# EAGLE design Adaptor (EAGLE 6.4)
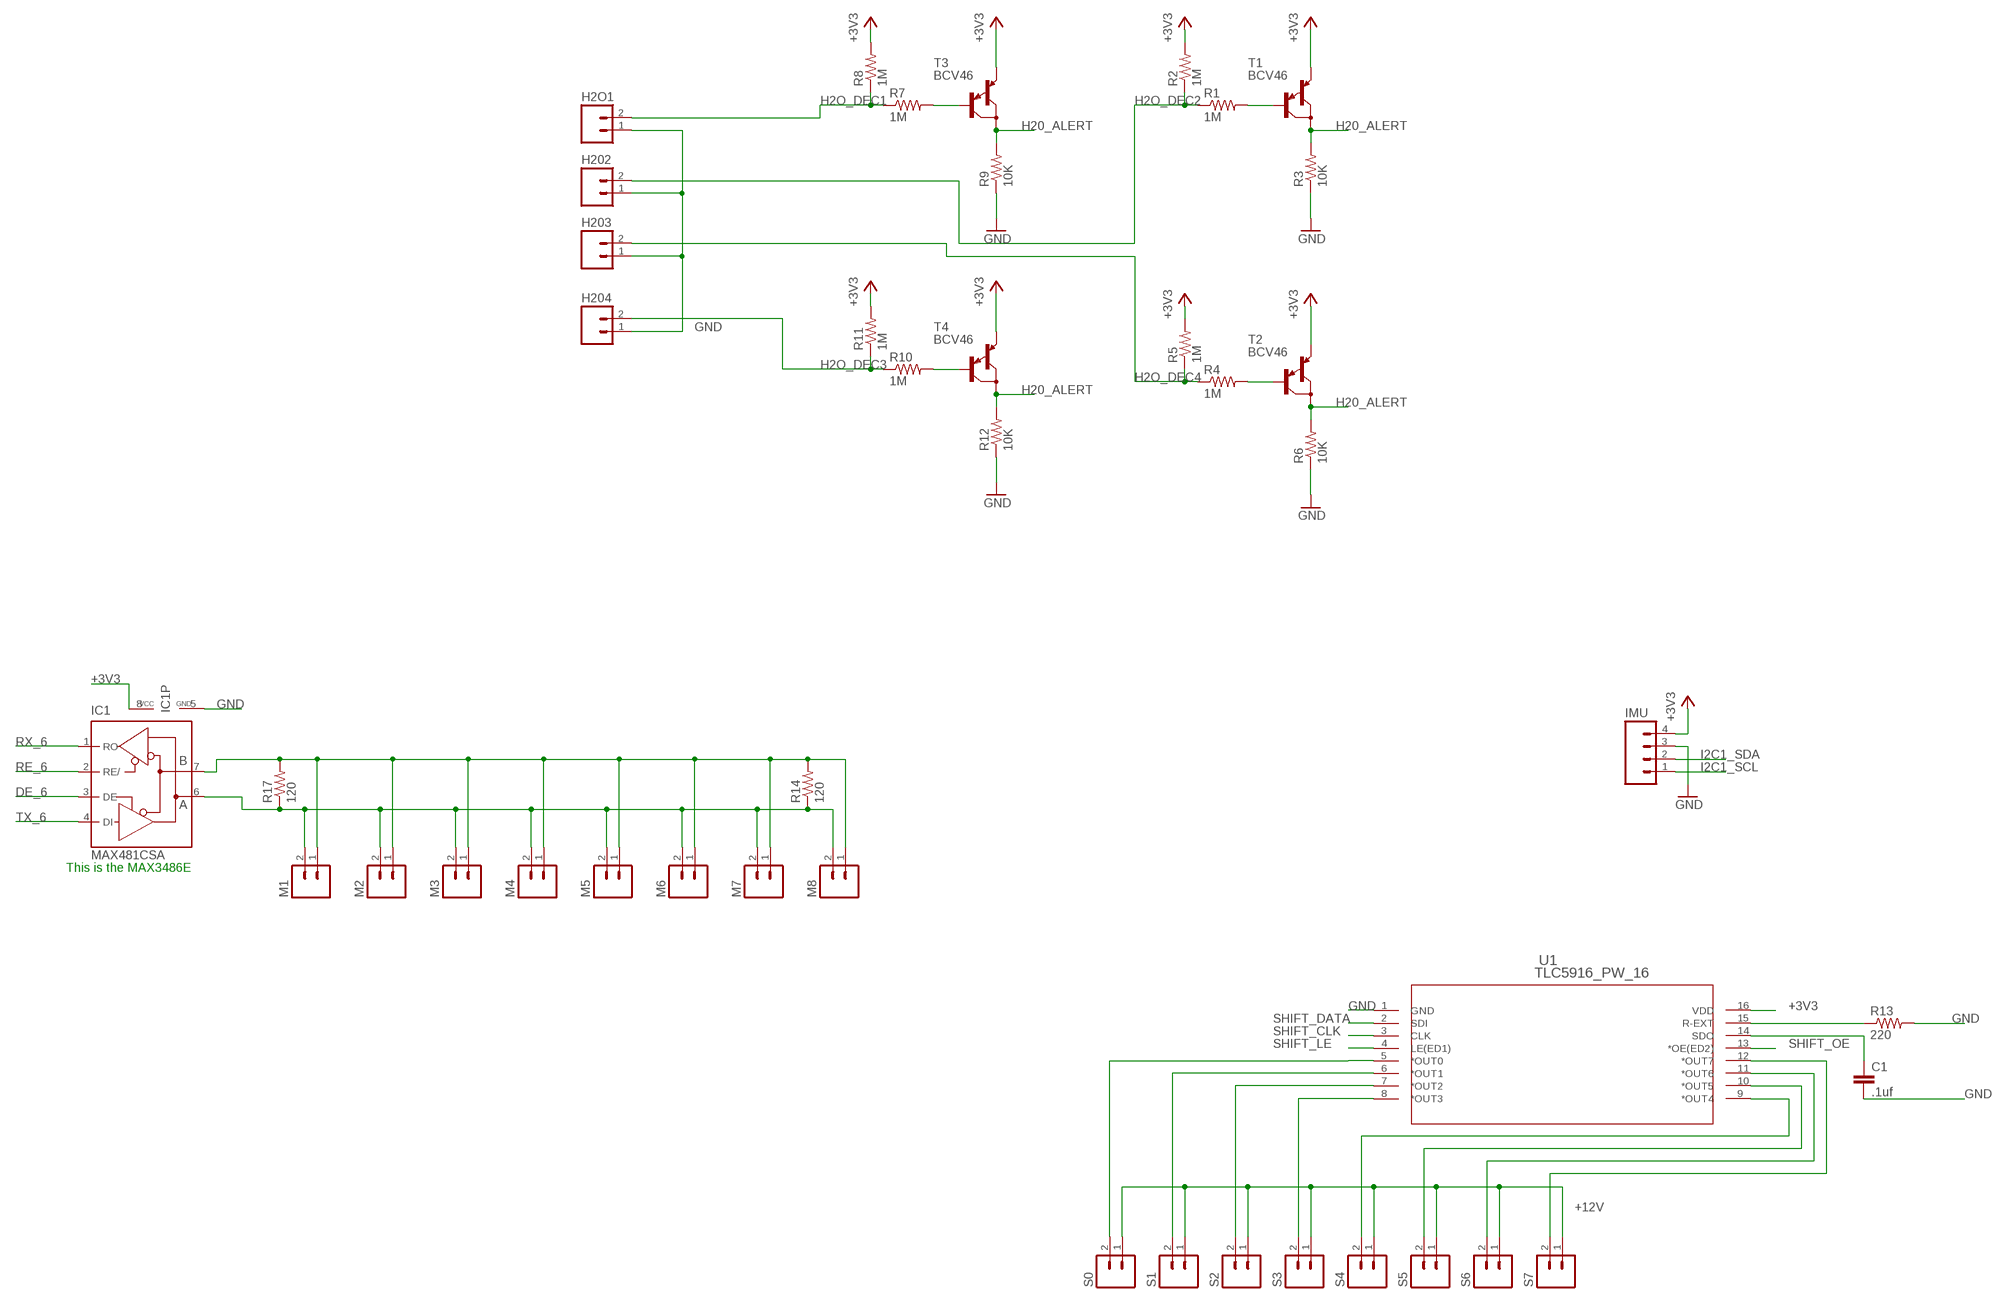
[diagram p0: schematic, sheet 1, part 1 of 2]
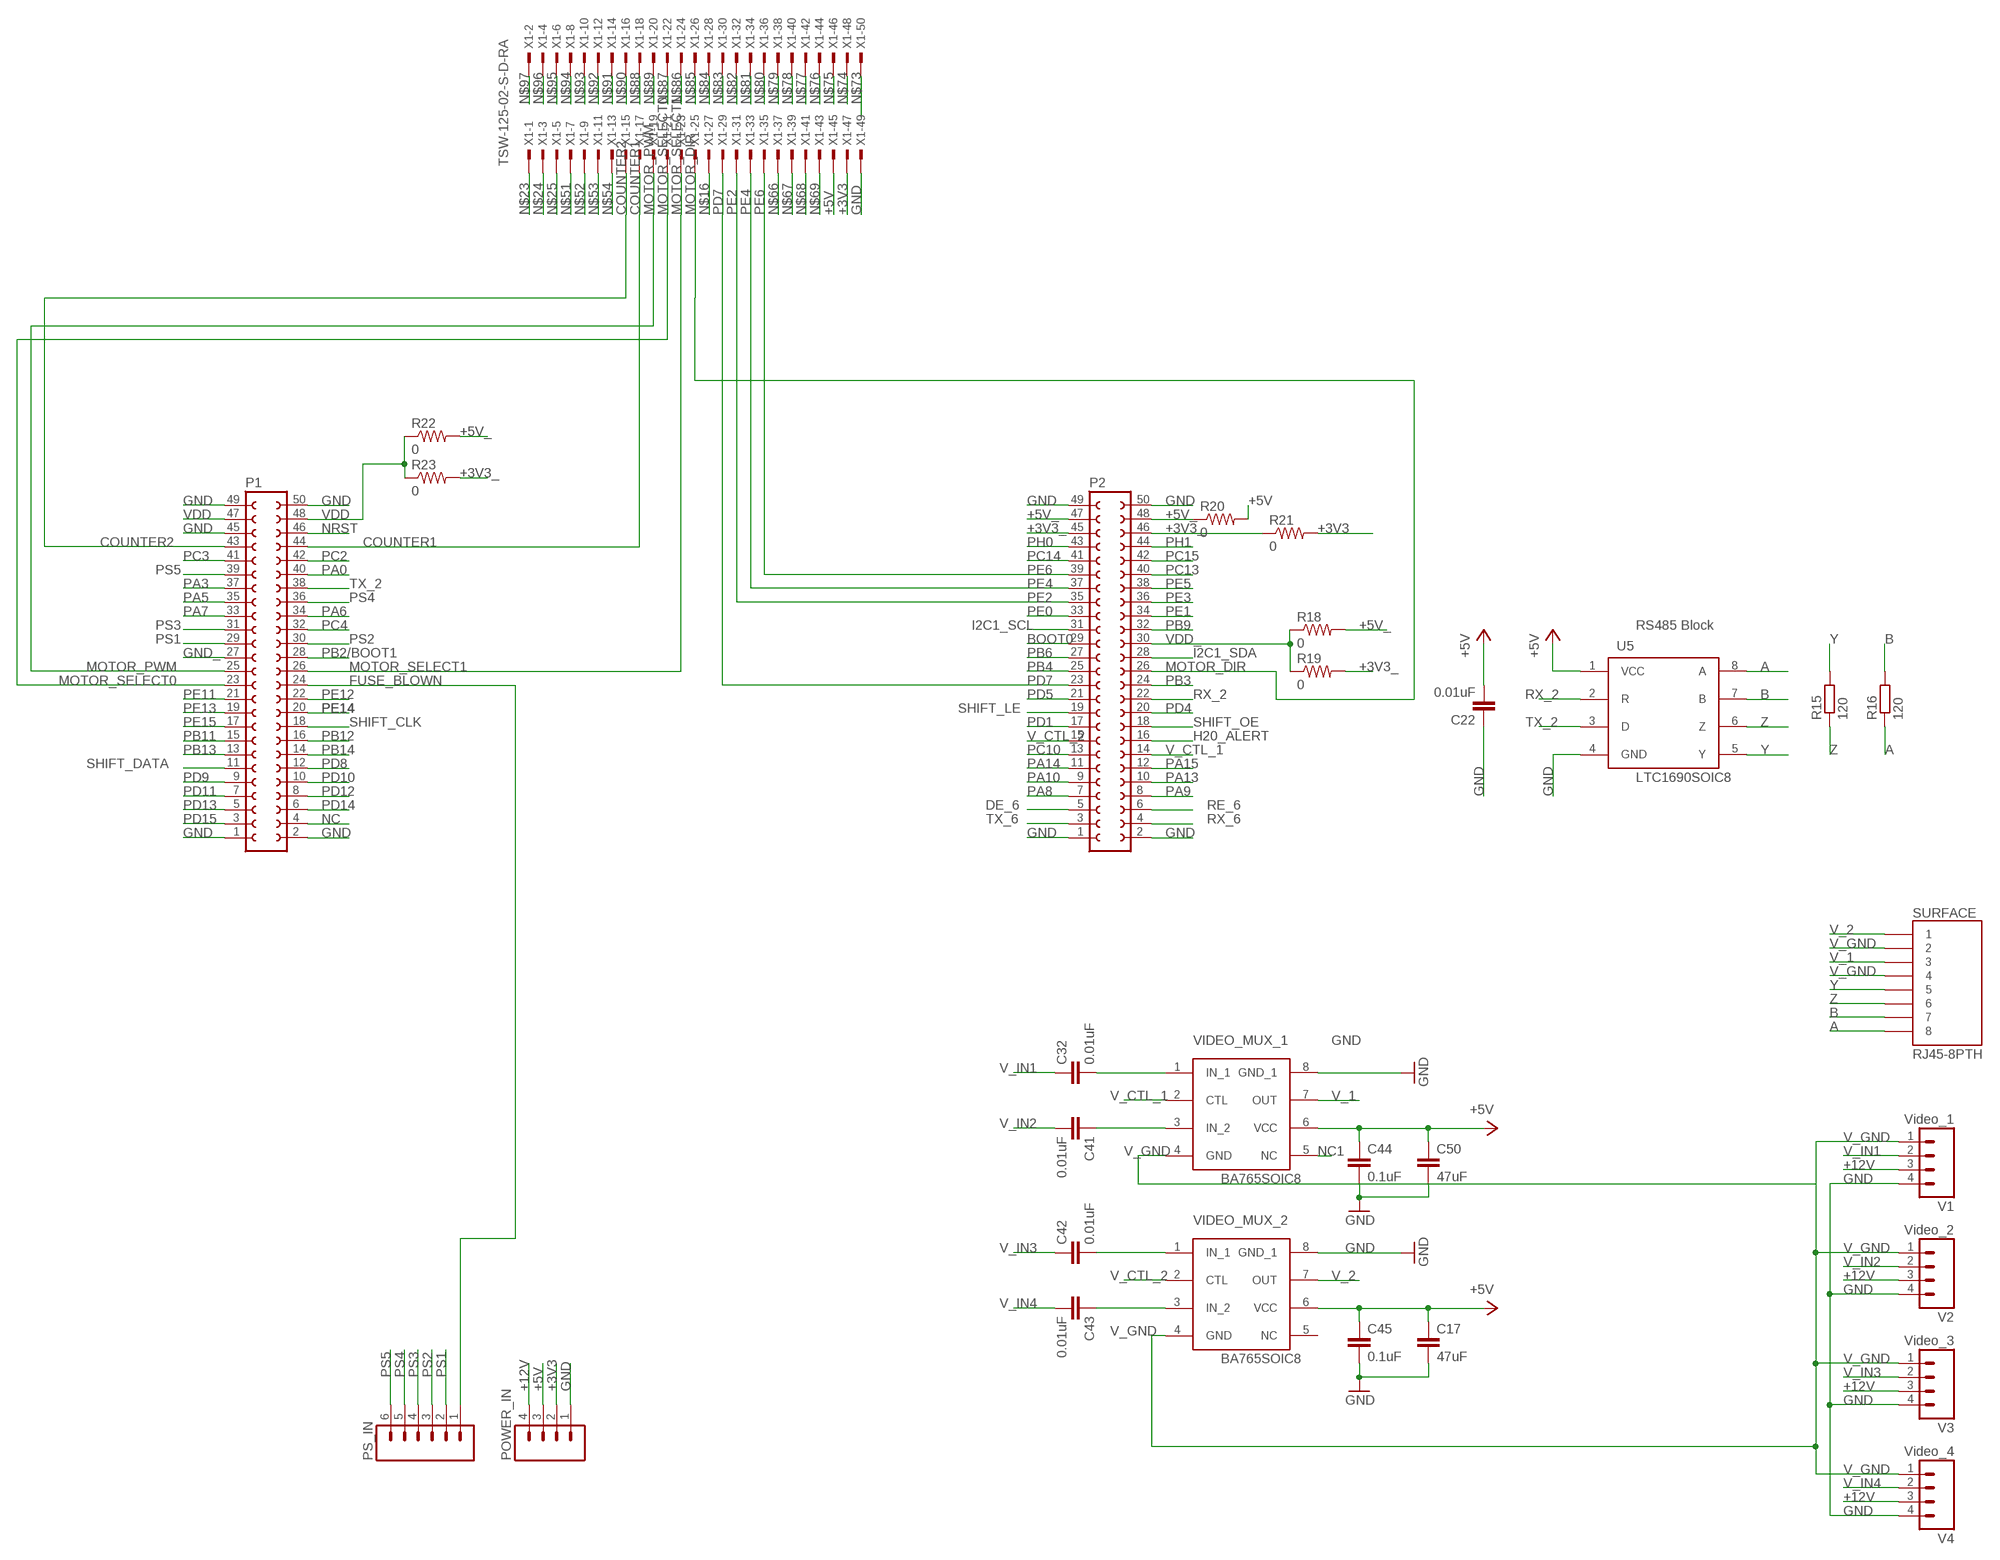
[diagram p1: schematic, sheet 1, part 2 of 2]

## Parts
C1  .1uf  CAP0805  [0805]
C17  47uF  C-EUC1206  [C1206]
C22  0.01uF  C-EUC0603  [C0603]
C32  0.01uF  C-EUC0603  [C0603]
C41  0.01uF  C-EUC0603  [C0603]
C42  0.01uF  C-EUC0603  [C0603]
C43  0.01uF  C-EUC0603  [C0603]
C44  0.1uF  C-EUC0603  [C0603]
C45  0.1uF  C-EUC0603  [C0603]
C50  47uF  C-EUC1206  [C1206]
H2O1  M02PTH  [1X02]
H202  M02PTH  [1X02]
H203  M02PTH  [1X02]
H204  M02PTH  [1X02]
IC1  MAX481CSA  [SO08]
IMU  M04PTH  [1X04]
M1  M02PTH  [1X02]
M2  M02PTH  [1X02]
M3  M02PTH  [1X02]
M4  M02PTH  [1X02]
M5  M02PTH  [1X02]
M6  M02PTH  [1X02]
M7  M02PTH  [1X02]
M8  M02PTH  [1X02]
P1  FE25-2  [FE25-2]
P2  FE25-2  [FE25-2]
POWER_IN  M04PTH  [1X04]
PS_IN  M06SIP  [1X06]
R1  1M  RESISTOR0805-RES  [0805]
R2  1M  RESISTOR0805-RES  [0805]
R3  10K  RESISTOR0805-RES  [0805]
R4  1M  RESISTOR0805-RES  [0805]
R5  1M  RESISTOR0805-RES  [0805]
R6  10K  RESISTOR0805-RES  [0805]
R7  1M  RESISTOR0805-RES  [0805]
R8  1M  RESISTOR0805-RES  [0805]
R9  10K  RESISTOR0805-RES  [0805]
R10  1M  RESISTOR0805-RES  [0805]
R11  1M  RESISTOR0805-RES  [0805]
R12  10K  RESISTOR0805-RES  [0805]
R13  220  RESISTOR0805-RES  [0805]
R14  120  RESISTOR0805-RES  [0805]
R15  120  R-EU_R0603  [R0603]
R16  120  R-EU_R0603  [R0603]
R17  120  RESISTOR0805-RES  [0805]
R18  0  RESISTOR0805-RES  [0805]
R19  0  RESISTOR0805-RES  [0805]
R20  0  RESISTOR0805-RES  [0805]
R21  0  RESISTOR0805-RES  [0805]
R22  0  RESISTOR0805-RES  [0805]
R23  0  RESISTOR0805-RES  [0805]
S0  M02PTH  [1X02]
S1  M02PTH  [1X02]
S2  M02PTH  [1X02]
S3  M02PTH  [1X02]
S4  M02PTH  [1X02]
S5  M02PTH  [1X02]
S6  M02PTH  [1X02]
S7  M02PTH  [1X02]
SURFACE  RJ45-8PTH  [RJ45-8]
T1  BCV46  MMBTA64LT1-PNP_DARL-SOT23-BEC  [SOT23-BEC]
T2  BCV46  MMBTA64LT1-PNP_DARL-SOT23-BEC  [SOT23-BEC]
T3  BCV46  MMBTA64LT1-PNP_DARL-SOT23-BEC  [SOT23-BEC]
T4  BCV46  MMBTA64LT1-PNP_DARL-SOT23-BEC  [SOT23-BEC]
U1  TLC5916_PW_16  [PW16]
U5  LTC1690SOIC8  [SOIC8]
V1  Video_1  M04PTH  [1X04]
V2  Video_2  M04PTH  [1X04]
V3  Video_3  M04PTH  [1X04]
V4  Video_4  M04PTH  [1X04]
VIDEO_MUX_1  BA765SOIC8  [SOIC8]
VIDEO_MUX_2  BA765SOIC8  [SOIC8]
X1  TSW-125-02-S-D-RA  [TSW-125-02-S-D-RA]

## Nets
+3V3: IC1.8(VCC) IMU.4 POWER_IN.2 R2.2 R5.2 R8.2 R11.2 R21.2 T1.E T2.E T3.E T4.E U1.16(VDD) X1.47
+3V3_: P2.45 P2.46 R19.2 R21.1 R23.2
+5V: C17.1 C22.2 C44.1 C45.1 C50.1 POWER_IN.3 R20.2 U5.1(VCC) VIDEO_MUX_1.6(VCC) VIDEO_MUX_2.6(VCC) X1.45
+5V_: P2.47 P2.48 R18.2 R20.1 R22.2
+12V: POWER_IN.4 S0.1 S1.1 S2.1 S3.1 S4.1 S5.1 S6.1 S7.1 V1.3 V2.3 V3.3 V4.3
A: R16.1 SURFACE.8 U5.8(A)
B: R16.2 SURFACE.7 U5.7(B)
BOOT0: P2.29
COUNTER1: P1.44 X1.17
COUNTER2: P1.43 X1.15
DE_6: IC1.3(DE) P2.5
FUSE_BLOWN: P1.24 PS_IN.1
GND: C1.2 C17.2 C22.1 C44.2 C45.2 C50.2 H2O1.1 H202.1 H203.1 H204.1 IC1.5(GND) IMU.3 P1.1 P1.2 P1.45 P1.49 P1.50 P2.1 P2.2 P2.49 P2.50 POWER_IN.1 R3.1 R6.1 R9.1 R12.1 R13.2 U1.1(GND) U5.4(GND) V1.4 V2.4 V3.4 V4.4 VIDEO_MUX_1.8(GND_1) VIDEO_MUX_2.8(GND_1) X1.49
GND_: P1.27
H2O_DEC1: H2O1.2 R7.1 R8.1
H2O_DEC2: H202.2 R1.1 R2.1
H2O_DEC3: H204.2 R10.1 R11.1
H2O_DEC4: H203.2 R4.1 R5.1
H20_ALERT: P2.16 R3.2 R6.2 R9.2 R12.2 T1.C T2.C T3.C T4.C
I2C1_SCL: IMU.1 P2.31
I2C1_SDA: IMU.2 P2.28
MOTOR_DIR: P2.26 X1.25
MOTOR_PWM: P1.25 X1.19
MOTOR_SELECT0: P1.23 X1.21
MOTOR_SELECT1: P1.26 X1.23
N$1: R1.2 T1.B
N$2: R4.2 T2.B
N$3: R7.2 T3.B
N$4: R10.2 T4.B
N$5: IC1.7(B) M1.1 M2.1 M3.1 M4.1 M5.1 M6.1 M7.1 M8.1 R14.2 R17.2
N$6: C32.2 VIDEO_MUX_1.1(IN_1)
N$8: C41.1 VIDEO_MUX_1.3(IN_2)
N$9: S0.2 U1.5(*OUT0)
N$10: S1.2 U1.6(*OUT1)
N$11: S2.2 U1.7(*OUT2)
N$12: S3.2 U1.8(*OUT3)
N$13: C42.2 VIDEO_MUX_2.1(IN_1)
N$14: R13.1 U1.15(R-EXT)
N$15: C1.1 U1.14(SDO)
N$16: X1.27
N$17: S7.2 U1.12(*OUT7)
N$18: S6.2 U1.11(*OUT6)
N$19: S5.2 U1.10(*OUT5)
N$20: S4.2 U1.9(*OUT4)
N$21: C43.1 VIDEO_MUX_2.3(IN_2)
N$22: IC1.6(A) M1.2 M2.2 M3.2 M4.2 M5.2 M6.2 M7.2 M8.2 R14.1 R17.1
N$23: X1.1
N$24: X1.3
N$25: X1.5
N$51: X1.7
N$52: X1.9
N$53: X1.11
N$54: X1.13
N$66: X1.37
N$67: X1.39
N$68: X1.41
N$69: X1.43
N$73: X1.50
N$74: X1.48
N$75: X1.46
N$76: X1.44
N$77: X1.42
N$78: X1.40
N$79: X1.38
N$80: X1.36
N$81: X1.34
N$82: X1.32
N$83: X1.30
N$84: X1.28
N$85: X1.26
N$86: X1.24
N$87: X1.22
N$88: X1.18
N$89: X1.20
N$90: X1.16
N$91: X1.14
N$92: X1.12
N$93: X1.10
N$94: X1.8
N$95: X1.6
N$96: X1.4
N$97: X1.2
NC: P1.4
NC1: VIDEO_MUX_1.5(NC)
NRST: P1.46
PA0: P1.40
PA3: P1.37
PA5: P1.35
PA6: P1.34
PA7: P1.33
PA8: P2.7
PA9: P2.8
PA10: P2.9
PA13: P2.10
PA14: P2.11
PA15: P2.12
PB2/BOOT1: P1.28
PB3: P2.24
PB4: P2.25
PB6: P2.27
PB9: P2.32
PB11: P1.15
PB12: P1.16
PB13: P1.13
PB14: P1.14
PC2: P1.42
PC3: P1.41
PC4: P1.32
PC10: P2.13
PC13: P2.40
PC14: P2.41
PC15: P2.42
PD1: P2.17
PD4: P2.20
PD5: P2.21
PD7: P2.23 X1.29
PD8: P1.12
PD9: P1.9
PD10: P1.10
PD11: P1.7
PD12: P1.8
PD13: P1.5
PD14: P1.6
PD15: P1.3
PE0: P2.33
PE1: P2.34
PE2: P2.35 X1.31
PE3: P2.36
PE4: P2.37 X1.33
PE5: P2.38
PE6: P2.39 X1.35
PE11: P1.21
PE12: P1.22
PE13: P1.19
PE14: P1.20
PE15: P1.17
PH0: P2.43
PH1: P2.44
PS1: P1.29 PS_IN.2
PS2: P1.30 PS_IN.3
PS3: P1.31 PS_IN.4
PS4: P1.36 PS_IN.5
PS5: P1.39 PS_IN.6
RE_6: IC1.2(RE/) P2.6
RX_2: P2.22 U5.2(R)
RX_6: IC1.1(RO) P2.4
SHIFT_CLK: P1.18 U1.3(CLK)
SHIFT_DATA: P1.11 U1.2(SDI)
SHIFT_LE: P2.19 U1.4(LE(ED1))
SHIFT_OE: P2.18 U1.13(*OE(ED2))
TX_2: P1.38 U5.3(D)
TX_6: IC1.4(DI) P2.3
V_1: SURFACE.3 VIDEO_MUX_1.7(OUT)
V_2: SURFACE.1 VIDEO_MUX_2.7(OUT)
V_CTL_1: P2.14 VIDEO_MUX_1.2(CTL)
V_CTL_2: P2.15 VIDEO_MUX_2.2(CTL)
V_GND: SURFACE.2 SURFACE.4 V1.1 V2.1 V3.1 V4.1 VIDEO_MUX_1.4(GND) VIDEO_MUX_2.4(GND)
V_IN1: C32.1 V1.2
V_IN2: C41.2 V2.2
V_IN3: C42.1 V3.2
V_IN4: C43.2 V4.2
VDD: P1.47 P1.48 R22.1 R23.1
VDD_: P2.30 R18.1 R19.1
Y: R15.2 SURFACE.5 U5.5(Y)
Z: R15.1 SURFACE.6 U5.6(Z)
Unconnected: VIDEO_MUX_2.5(NC)

## Notes on the sheet
- RS485 Block
- This is the MAX3486E

## Library data of the parts
C1 = SparkFun-Passives:CAP: Capacitor Standard 0603 ceramic capacitor, and 0.1" leaded capacitor.
C17 C50 = resistor:C-EU: CAPACITOR, European symbol; BOM: INCLUDE; PARTNO: 490-5528-1-ND
C22 C32 C41-C43 = resistor:C-EU: CAPACITOR, European symbol; BOM: INCLUDE; PARTNO: 478-1227-1-ND
C44 C45 = resistor:C-EU: CAPACITOR, European symbol; BOM: INCLUDE; PARTNO: 311-1344-1-ND
H2O1 H202-H204 M1-M8 S0 S1-S7 = SparkFun-Connectors:M02: Header 2 Standard 2-pin 0.1" header. Use with straight break away headers (SKU : PRT-00116), right angle break away headers (PRT-00553), swiss pins (PRT-00743), machine pins (PRT-00117), and female headers (PRT-00115). Molex polarized connector foot print use with SKU : PRT-08233 with associated crimp pins and housings.
IC1 = maxim:MAX481CSA: RS485 TRANSEIVER; MF: MAXIM; MPN: MAX481CSA; OC_FARNELL: unknown; OC_NEWARK: 90C3817
IMU POWER_IN V1-V4 = SparkFun-Connectors:M04: Header 4 Standard 4-pin 0.1" header. Use with straight break away headers (SKU : PRT-00116), right angle break away headers (PRT-00553), swiss pins (PRT-00743), machine pins (PRT-00117), and female headers (PRT-00115). Molex polarized connector foot print use with SKU : PRT-08231 with associated crimp pins and housings. 1MM SMD Version SKU: PRT-10208
P1 P2 = con-lsta:FE25-2: FEMALE HEADER; OC_FARNELL: unknown; OC_NEWARK: unknown
PS_IN = SparkFun-Connectors:M06: Header 6 Standard 6-pin 0.1" header. Use with straight break away headers (SKU : PRT-00116), right angle break away headers (PRT-00553), swiss pins (PRT-00743), machine pins (PRT-00117), and female headers (PRT-00115). Molex polarized connector foot print use with SKU : PRT-08094 with associated crimp pins and housings. NOTES ON THE VARIANTS LOCK and LOCK_LONGPADS... This footprint was designed to help hold the alignment of a through-hole component (i.e. 6-pin header) while soldering it into place. You may notice that each hole has been shifted either up or down by 0.005 of an inch from it's more standard position (which is a perfectly straight line). This slight alteration caused the pins (the squares in the middle) to touch the edges of the holes. Because they are alternating, it causes a "brace" to hold the component in place. 0.005 has proven to be the perfect amount of "off-center" position when using our standard breakaway headers. Although looks a little odd when you look at the bare footprint, once you have a header in there, the alteration is very hard to notice. Also, if you push a header all the way into place, it is covered up entirely on the bottom side. This idea of altering the position of holes to aid alignment will be further integrated into the Sparkfun Library for other footprints. It can help hold any component with 3 or more connection pins.
R1-R12 R18-R23 = SparkFun-Resistors:RESISTOR: Resistor Basic schematic elements and footprints for 0603, 1206, and PTH resistors.
R13 R14 R17 = SparkFun-Passives:RESISTOR: Resistor Basic schematic elements and footprints for 0603, 1206, and PTH resistors.
R15 R16 = resistor:R-EU_: RESISTOR, European symbol
SURFACE = SparkFun-Connectors:RJ45-8: RJ45 Jack Simple RJ45, 8-pin connection - connector for common Cat5, Cat5e, and Cat6 Ethernet cables. Footprint not yet proven in production. Connector sku is PRT-00643; Breakout PCB sku is BOB-00716.
T1-T4 = transistor-neu-to92:*-PNP_DARL-: PNP Darlington Transistor
U1 = tlc5916:TLC5916_PW_16; DATASHEETURL: http://www.ti.com/lit/gpn/TLC5916; DESCRIPTION: 8-Bit Constant-Current LED Sink Driver; FAMILY_NAME: LED DRIVER; GENERIC_PART_NUMBER: TLC5916; INDUSTRY_STD_PKG_TYPE: TSSOP; MANUFACTURER: Texas Instruments; MANUFACTURER_PART_NUMBER: tlc5916_pw_16; PACKAGE_DESIGNATOR: PW; PIN_COUNT: 16; VENDOR: Texas Instruments
U5 = ltc1690:LTC1690: RS485 transciever
VIDEO_MUX_1 VIDEO_MUX_2 = ba765:BA765
X1 = con-samtec:TSW-125-02-S-D: THROUGH-HOLE .025" SQ POST HEADER Source: Samtec TSW.pdf; OC_FARNELL: unknown; OC_NEWARK: unknown

## Board
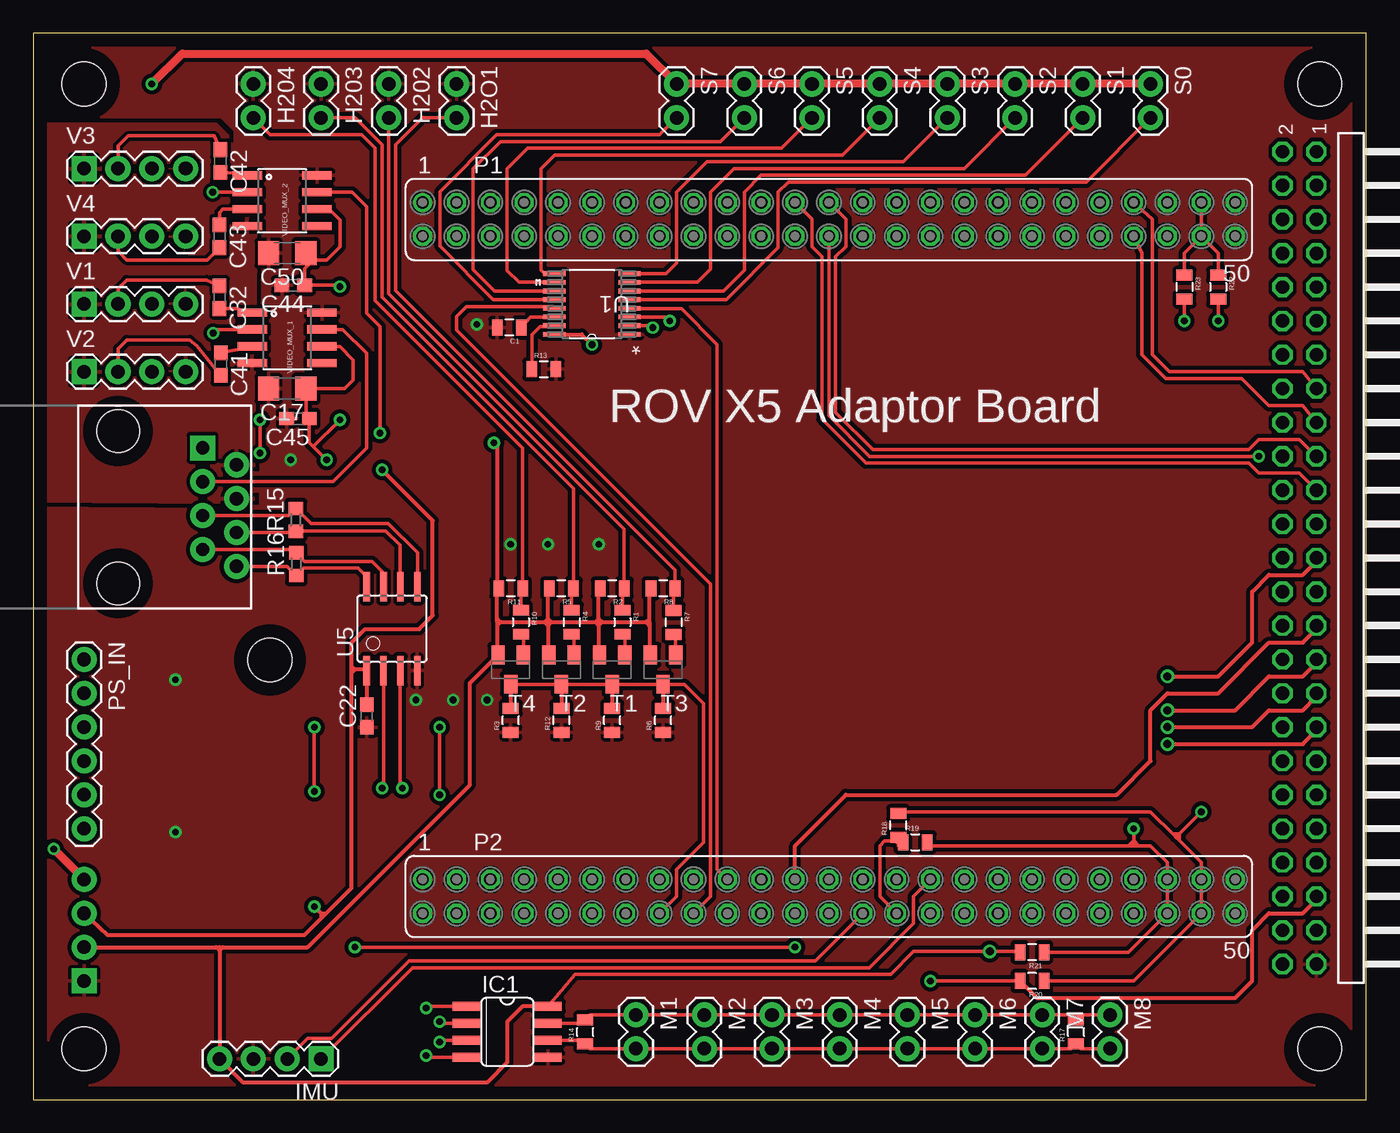
[diagram p2: board, top side]
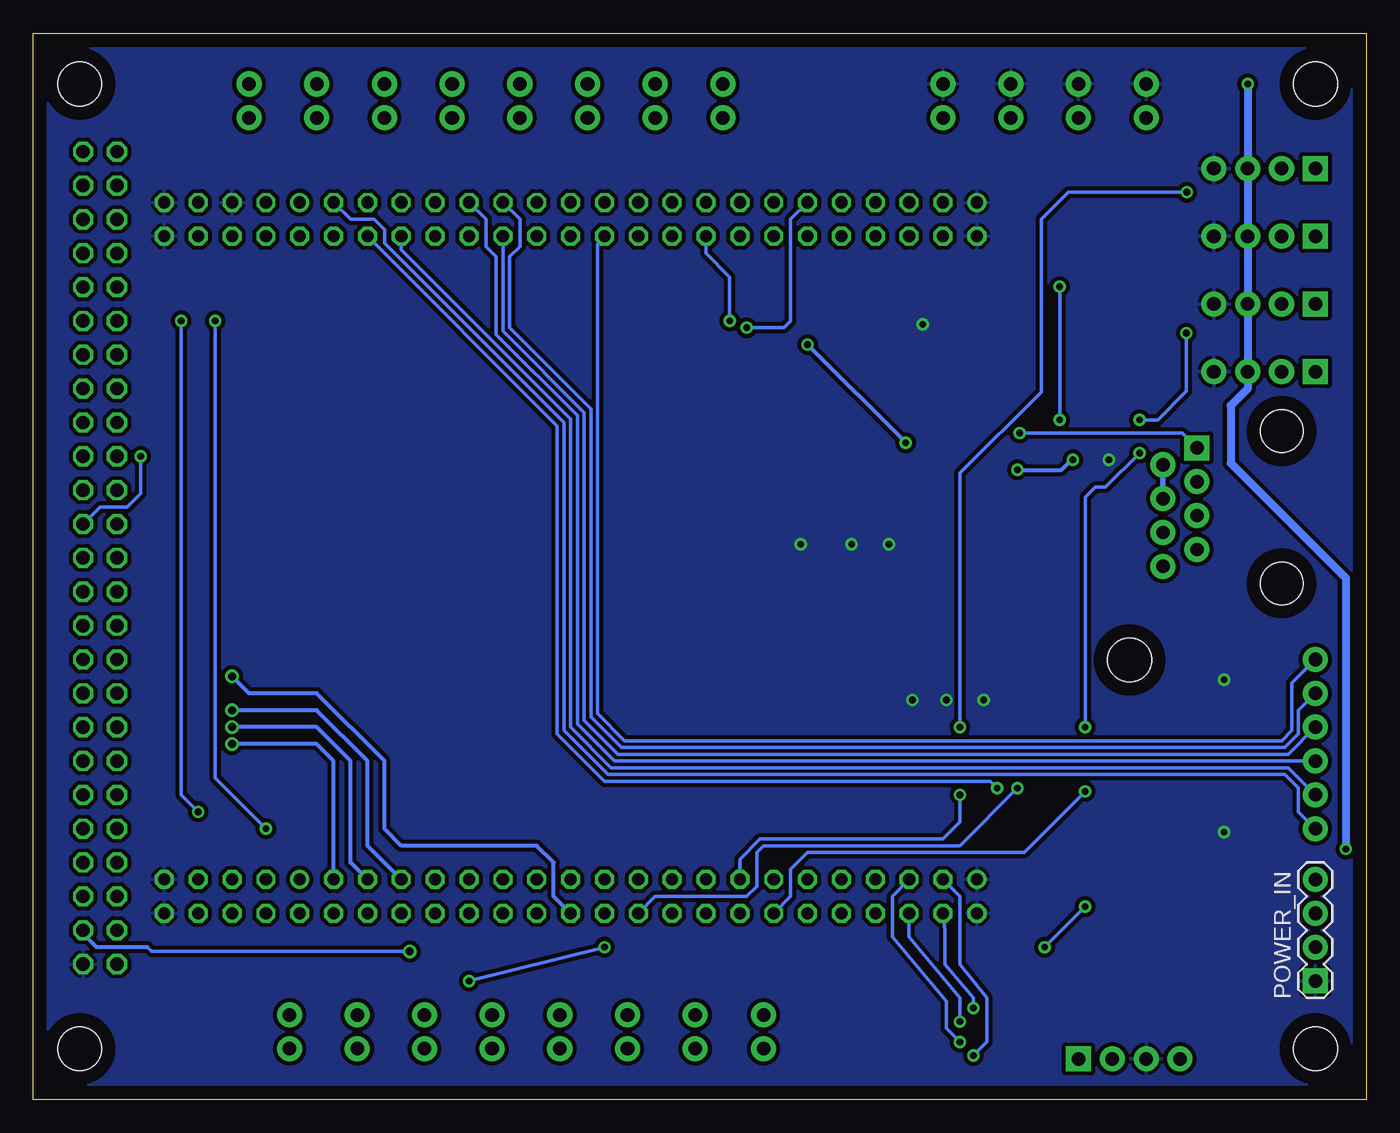
[diagram p3: board, bottom side, seen from below]

Size 100 x 80 mm. Coordinates in mm from the lower left corner, seen from the top.
Outline: 0,0 100,0 100,80 0,80 0,0
Copper layers (1*16): Top 0.035mm / dielectric 1.5mm / Bottom 0.035mm
Design rules "default": minimum track width 10mil, minimum drill 15mil, track to track 8mil, track to pad 8mil, pad to pad 8mil, via to via 8mil, smd to smd 8mil, copper to edge 40mil, drill to drill 8mil, minimum pad ring 10mil, minimum via ring 8mil, stop-mask expansion 4mil, vias tented up to drill 0mil, thermal gap 10mil

### Footprints (pad centres in the part's own frame; a part is rotated, then mirrored left to right if it is on the bottom)
0805 = smd 0.8 x 1.2: 1 -0.9,0; 2 0.9,0
C1206 = smd 1.6 x 1.8: 1 -1.4,0; 2 1.4,0
C0603 = smd 1.1 x 1: 1 -0.85,0; 2 0.85,0
1X02 = drill 1.016 pad 1.88: 1 0,0; 2 2.54,0
SO08 = smd 0.66 x 2.032: 1 -1.905,-3.073; 2 -0.635,-3.073; 3 0.635,-3.073; 4 1.905,-3.073; 5 1.905,3.073; 6 0.635,3.073; 7 -0.635,3.073; 8 -1.905,3.073
1X04 = drill 1.016 pad 1.88 square: 1 0,0 | drill 1.016 pad 1.88: 2 2.54,0; 3 5.08,0; 4 7.62,0
FE25-2 = drill 0.914: 1 -30.48,1.27; 41 20.32,1.27 | drill 0.914 octagon: 2 -30.48,-1.27; 3 -27.94,1.27; 4 -27.94,-1.27; 5 -25.4,1.27; 6 -25.4,-1.27; 7 -22.86,1.27; 8 -22.86,-1.27; 9 -20.32,1.27; 10 -20.32,-1.27; 11 -17.78,1.27; 12 -17.78,-1.27; 13 -15.24,1.27; 14 -15.24,-1.27; 15 -12.7,1.27; 16 -12.7,-1.27; 17 -10.16,1.27; 18 -10.16,-1.27; 19 -7.62,1.27; 20 -7.62,-1.27; 21 -5.08,1.27; 22 -5.08,-1.27; 23 -2.54,1.27; 24 -2.54,-1.27; 25 0,1.27; 26 0,-1.27; 27 2.54,1.27; 28 2.54,-1.27; 29 5.08,1.27; 30 5.08,-1.27; 31 7.62,1.27; 32 7.62,-1.27; 33 10.16,1.27; 34 10.16,-1.27; 35 12.7,1.27; 36 12.7,-1.27; 37 15.24,1.27; 38 15.24,-1.27; 39 17.78,1.27; 40 17.78,-1.27; 42 20.32,-1.27; 43 22.86,1.27; 44 22.86,-1.27; 45 25.4,1.27; 46 25.4,-1.27; 47 27.94,1.27; 48 27.94,-1.27; 49 30.48,1.27; 50 30.48,-1.27
1X06 = drill 1.016 pad 1.88: 1 0,0; 2 2.54,0; 3 5.08,0; 4 7.62,0; 5 10.16,0; 6 12.7,0
R0603 = smd 1 x 1.1: 1 -0.85,0; 2 0.85,0
RJ45-8 = drill 1 pad 1.88 square: 1 -4.445,6.35 | drill 1 pad 1.88: 2 -3.175,8.89; 3 -1.905,6.35; 4 -0.635,8.89; 5 0.635,6.35; 6 1.905,8.89; 7 3.175,6.35; 8 4.445,8.89 | hole 3.2: -5.715,0; 5.715,0
SOT23-BEC = smd 1 x 1.4: B -0.95,-1.1; C 0,1.1; E 0.95,-1.1
PW16 = smd 1.676 x 0.356: 1 -2.819,2.286; 2 -2.819,1.626; 3 -2.819,0.965; 4 -2.819,0.33; 5 -2.819,-0.33; 6 -2.819,-0.965; 7 -2.819,-1.626; 8 -2.819,-2.286; 9 2.819,-2.286; 10 2.819,-1.626; 11 2.819,-0.965; 12 2.819,-0.33; 13 2.819,0.33; 14 2.819,0.965; 15 2.819,1.626; 16 2.819,2.286
SOIC8 = smd 0.5 x 2.2: 1 -1.905,-3.154; 2 -0.645,-3.154; 3 0.625,-3.154; 4 1.895,-3.154; 5 1.905,3.154; 6 0.635,3.154; 7 -0.635,3.154; 8 -1.905,3.154
STAND-OFF = hole 3.302: 0,0
SOIC8' = smd 0.61 x 2.21: 1 -1.905,-2.616; 2 -0.635,-2.616; 3 0.635,-2.616; 4 1.905,-2.616; 5 1.905,2.616; 6 0.635,2.616; 7 -0.635,2.616; 8 -1.905,2.616
TSW-125-02-S-D-RA = drill 1 pad 1.5 octagon: 1 30.48,1.524; 2 30.48,4.064; 3 27.94,1.524; 4 27.94,4.064; 5 25.4,1.524; 6 25.4,4.064; 7 22.86,1.524; 8 22.86,4.064; 9 20.32,1.524; 10 20.32,4.064; 11 17.78,1.524; 12 17.78,4.064; 13 15.24,1.524; 14 15.24,4.064; 15 12.7,1.524; 16 12.7,4.064; 17 10.16,1.524; 18 10.16,4.064; 19 7.62,1.524; 20 7.62,4.064; 21 5.08,1.524; 22 5.08,4.064; 23 2.54,1.524; 24 2.54,4.064; 25 0,1.524; 26 0,4.064; 27 -2.54,1.524; 28 -2.54,4.064; 29 -5.08,1.524; 30 -5.08,4.064; 31 -7.62,1.524; 32 -7.62,4.064; 33 -10.16,1.524; 34 -10.16,4.064; 35 -12.7,1.524; 36 -12.7,4.064; 37 -15.24,1.524; 38 -15.24,4.064; 39 -17.78,1.524; 40 -17.78,4.064; 41 -20.32,1.524; 42 -20.32,4.064; 43 -22.86,1.524; 44 -22.86,4.064; 45 -25.4,1.524; 46 -25.4,4.064; 47 -27.94,1.524; 48 -27.94,4.064; 49 -30.48,1.524; 50 -30.48,4.064

### Placement (x,y rotation side)
C1  35.71,57.92 180 top
C17  19.05,53.34 180 top
C22  25.02,28.78 90 top
C32  13.97,60.19 270 top
C41  14.07,55.19 270 top
C42  14.03,70.42 270 top
C43  13.97,64.77 270 top
C44  19.5,61.09 180 top
C45  19.85,51.09 180 top
C50  19.05,63.5 180 top
H2O1  31.75,76.2 270 top
H202  26.67,76.2 270 top
H203  21.59,76.2 270 top
H204  16.51,76.2 270 top
IC1  35.56,5.08 270 top
IMU  21.59,3.05 180 top
M1  45.21,6.35 270 top
M2  50.34,6.35 270 top
M3  55.42,6.35 270 top
M4  60.5,6.35 270 top
M5  65.58,6.35 270 top
M6  70.66,6.35 270 top
M7  75.69,6.35 270 top
M8  80.77,6.35 270 top
P1  59.69,66.04 0 top
P2  59.69,15.24 0 top
POWER_IN  3.81,8.89 90 bottom
PS_IN  3.81,33.02 270 top
R1  44.2,35.81 270 top
R2  43.43,38.35 180 top
R3  35.81,28.45 90 top
R4  40.39,35.81 270 top
R5  39.62,38.35 180 top
R6  47.24,28.45 90 top
R7  48.04,35.79 270 top
R8  47.24,38.35 180 top
R9  43.43,28.45 90 top
R10  36.58,35.81 270 top
R11  35.81,38.35 180 top
R12  39.62,28.45 90 top
R13  38.3,54.79 0 top
R14  41.4,5.08 90 top
R15  19.69,43.5 90 top
R16  19.73,40.16 90 top
R17  78.23,5.08 90 top
R18  64.9,20.57 90 top
R19  66.17,19.3 0 top
R20  74.93,8.89 180 top
R21  74.93,11.05 180 top
R22  88.9,60.96 270 top
R23  86.36,60.96 270 top
S0  83.82,76.2 270 top
S1  78.74,76.2 270 top
S2  73.66,76.2 270 top
S3  68.58,76.2 270 top
S4  63.5,76.2 270 top
S5  58.42,76.2 270 top
S6  53.34,76.2 270 top
S7  48.26,76.2 270 top
SURFACE  6.35,44.45 270 top
T1  43.43,32.26 180 top
T2  39.62,32.26 180 top
T3  47.24,32.26 180 top
T4  35.81,32.26 180 top
U1  41.91,59.69 180 top
U5  26.91,35.33 0 top
U$1  [STAND-OFF]  3.81,76.2 0 top
U$2  [STAND-OFF]  3.81,3.81 0 top
U$3  [STAND-OFF]  96.52,3.81 0 top
U$4  [STAND-OFF]  96.52,76.2 0 top
U$5  [STAND-OFF]  17.75,32.98 0 top
V1  3.81,59.69 0 top
V2  3.81,54.61 0 top
V3  3.81,69.85 0 top
V4  3.81,64.77 0 top
VIDEO_MUX_1  BA765SOIC8  [SOIC8']  19.05,57.15 270 top
VIDEO_MUX_2  BA765SOIC8  [SOIC8']  18.67,67.44 270 top
X1  97.79,40.64 90 top

### Tracks (layer width: path | path; a pad name or v marks a point on that pad's centre or on a via)
+3V3  (via drill 0.51, 0.6)
  Top 0.254: IC1.8 40.64,9.4 64.33,9.4 66.04,11.11 v71.75,11.11 73.97,11.11 R21.2
  Top 0.305: POWER_IN.2 13.72,11.43 | 13.72,11.43 13.97,11.43 | 13.97,11.43 13.97,11.18 | 13.97,11.18 IMU.4 15.75,1.27 34.04,1.27 35.56,2.79 35.56,5.84 36.7,6.99 IC1.8 | 46.29,38.3 R8.2 46.23,38.24 46.23,36.07 | 34.8,35.81 35.05,35.81 | 35.05,35.81 38.35,35.81 | 38.35,35.81 38.61,35.81 | 38.61,35.81 38.86,35.81 | 38.86,35.81 42.16,35.81 | 42.16,35.81 42.42,35.81 | 42.42,35.81 42.67,35.81 | 42.67,35.81 45.97,35.81 | 45.97,35.81 46.23,35.81 | 46.23,35.81 46.23,35.56 | 46.23,35.56 46.23,33.42 T3.E | 46.23,35.81 46.23,36.07 | 46.23,36.07 45.97,35.81 | 45.97,35.81 46.23,35.56 | 42.42,35.81 42.42,35.56 | 42.42,35.56 42.42,33.42 T1.E | 42.42,35.81 42.42,36.07 | 42.42,36.07 42.42,38.24 R2.2 | 42.42,36.07 42.16,35.81 | 42.16,35.81 42.42,35.56 | 42.42,35.56 42.67,35.81 | 42.67,35.81 42.42,36.07 | 38.61,35.81 38.61,36.07 | 38.61,36.07 38.61,38.24 R5.2 | 38.61,35.81 38.61,35.56 | 38.61,35.56 38.61,33.42 T2.E | 38.35,35.81 38.61,36.07 | 38.61,36.07 38.86,35.81 | 38.86,35.81 38.61,35.56 | 38.61,35.56 38.35,35.81 | 34.8,35.81 34.8,36.07 | 34.8,36.07 34.8,38.24 R11.2 34.8,38.47 34.8,49.02 v34.54,49.28 | 34.8,35.81 34.8,35.56 | 34.8,35.56 34.8,33.42 T4.E 32.77,31.24 32.77,23.62 20.57,11.43 14.22,11.43 | 34.8,36.07 35.05,35.81 | 35.05,35.81 34.8,35.56 | U1.16 41.15,57.4 v41.91,56.64 | 13.97,11.43 14.22,11.43 | 14.22,11.43 13.97,11.18 | 13.97,11.18 13.72,11.43
  Bottom 0.254: v71.75,11.11 91.12,11.11 91.44,11.43
  Bottom 0.305: v41.91,56.64 v34.54,49.28 | 91.44,11.43 95.25,11.43 96.27,12.45 X1.47
+3V3_  (via drill 0.51)
  Top 0.254: 82.93,19.05 83.82,19.05 85.09,17.78 P2.45 P2.46 82.17,11.05 R21.1 | 82.93,19.05 82.55,19.05 | 82.17,19.05 67.31,19.05 67.31,19.06 R19.2 | R23.2 v86.36,58.42 | v82.55,20.32 82.55,19.43 | 82.55,19.43 82.55,19.05 | 82.55,19.43 82.17,19.05 | 82.17,19.05 82.55,19.05 | 82.93,19.05 82.55,19.43
  Bottom 0.254: v86.36,58.42 86.36,24.13 v82.55,20.32
+5V  (via drill 0.51)
  Top 0.254: VIDEO_MUX_2.6 22.2,66.8 23,66 23,64 22,63 21,63 | 21,63 20.95,63 C50.1 | 21,63 20.35,62.35 C44.1 22.91,61.09 v23,61 | VIDEO_MUX_1.6 21.68,56.5 23,56.5 24,55.5 24,54 23.34,53.34 C17.1 20.45,51.34 C45.1 20.7,49.3 21,49 | 21,49 v22,48 | v23,51 21,49 | v57.15,11.43 v24.13,11.43 | v67.31,8.89 R20.2
  Top 0.305: 23.88,32 23.88,15.88 21.97,13.97 | 23.88,32 23.88,32.26 | 23.88,32.26 23.88,32.51 | 24.13,32.26 24.92,32.26 U5.1 25,29.64 C22.2 | 24.13,32.26 23.88,32.26 | 23.88,32.51 24.13,32.26 | 24.13,32.26 23.88,32 | 23.88,32.51 23.88,34.29 24.89,35.31 28.96,35.31 29.97,36.32 29.97,43.43 v26.16,47.24 | POWER_IN.3 5.59,12.32 20.32,12.32 21.59,13.59 | v21.08,14.48 21.59,13.97 | 21.59,13.97 21.97,13.97 | 21.59,13.97 21.59,13.59 | 21.59,13.59 21.97,13.97 | R20.2 75.3,7.62 90.17,7.62 91.44,8.89 91.44,12.7 92.71,13.97 95.25,13.97 96.27,14.99 X1.45
  Bottom 0.254: v23,61 v23,51 | v67.31,8.89 v57.15,11.43 | v24.13,11.43 v21.08,14.48
  Bottom 0.305: v26.16,47.24 22.86,47.24 22.1,48.01 22.09,48 v22,48
+5V_  (via drill 0.51)
  Top 0.254: 85.98,19.43 87.63,17.78 P2.47 P2.48 82.55,8.89 R20.1 | 85.98,19.43 85.72,19.68 | 85.72,19.68 85.6,19.81 | 85.6,19.81 83.82,21.59 64.78,21.59 | 64.77,21.59 64.78,21.59 | 64.78,21.59 R18.2 | R22.2 v88.9,58.42 | v87.63,21.59 85.98,19.94 | 85.85,19.81 85.72,19.68 | 85.98,19.43 85.98,19.94 | 85.6,19.81 85.85,19.81 | 85.85,19.81 85.98,19.94 | 85.98,19.94 85.6,19.94
  Bottom 0.254: v88.9,58.42 88.9,22.86 v87.63,21.59
+12V  (via drill 0.51)
  Top 0.61: S0.1 S1.1 S2.1 S3.1 S4.1 S5.1 S6.1 S7.1 45.97,78.49 11.18,78.49 v8.89,76.2 | v1.52,18.8 POWER_IN.4
  Bottom 0.61: v8.89,76.2 V3.3 V4.3 V1.3 V2.3 8.89,53.34 10.16,52.07 10.16,47.75 1.52,39.12 v1.52,18.8
A
  Top 0.254: U5.8 25,39.26 24.38,39.88 20.29,39.88 R16.1 19.04,40.01 SURFACE.8
B
  Top 0.254: SURFACE.7 19.46,41.27 R16.2 20.35,40.39 25.4,40.39 26.27,39.51 U5.7
COUNTER1
  Top 0.254: X1.17 95.25,52.07 92.71,52.07 90.68,54.1 84.96,54.1 83.19,55.88 83.19,63.5 P1.44
COUNTER2
  Top 0.254: X1.15 95.25,54.61 85.22,54.61 83.95,55.88 83.95,66.04 P1.43
DE_6  (via drill 0.51)
  Top 0.254: IC1.3 30.61,4.45 v30.48,4.32
  Bottom 0.254: v30.48,4.32 31.5,5.33 31.5,7.37 35.56,12.19 35.56,15.24 P2.5
FUSE_BLOWN
  Bottom 0.254: P1.24 57.15,64.71 57.66,64.2 57.66,28.96 55.63,26.92 6.35,26.92 5.59,27.69 5.59,31.24 PS_IN.1
GND  (via drill 0.51)
  other vias: 33.27,58.17 28.7,29.97 31.5,29.97 34.04,29.97 38.61,41.66 42.42,41.66 35.81,41.66 10.67,31.5 10.67,20.07 19.3,48.01
  pour Top (isolate 0.305, rank 6): 0,80.01 100.33,80.01 100.33,0 0,0
  pour Bottom (isolate 0.305, rank 6): 0,80 100,80 100,0 0,0
H2O_DEC1
  Top 0.254: H2O1.2 29.21,73.66 27.18,71.63 27.18,60.71 48.14,39.74 R8.1 48.04,38.25 R7.1
H2O_DEC2
  Top 0.254: H202.2 26.67,60.45 44.33,42.79 R2.1 44.2,38.22 R1.1
H2O_DEC3
  Top 0.254: H204.2 17.78,72.39 24.64,72.39 25.65,71.37 25.65,59.94 36.71,48.88 R11.1 36.58,38.22 R10.1
H2O_DEC4
  Top 0.254: H203.2 24.13,73.66 26.16,71.63 26.16,60.2 40.52,45.84 R5.1 40.39,38.22 R4.1
H20_ALERT
  Top 0.254: P2.16 48.26,15.24 48.26,17.27 50.29,19.3 50.29,29.72 48.85,31.16 T3.C T1.C T2.C T4.C
  Top 0.305: T4.C R3.2 | T2.C R12.2 | T1.C R9.2 | T3.C R6.2
I2C1_SCL
  Top 0.254: IMU.1 28.44,9.9 62.73,9.9 66.04,13.21 66.04,15.24 P2.31
I2C1_SDA
  Top 0.254: IMU.2 20.59,4.59 22.37,4.59 28.19,10.41 58.67,10.41 P2.28
MOTOR_DIR  (via drill 0.6)
  Top 0.305: v85.09,31.75 88.9,31.75 91.44,34.29 91.44,38.1 92.71,39.37 95.25,39.37 96.27,40.39 X1.25
  Bottom 0.305: P2.26 60.96,15.24 60.96,17.78 62.23,19.05 72.39,19.05 73.66,20.32 73.66,25.4 78.74,30.48 83.82,30.48 v85.09,31.75
MOTOR_PWM
  Top 0.254: X1.19 95,49.53 91.95,49.53 91.19,48.77 62.99,48.77 60.2,51.56 60.2,63.25 60.96,64.01 60.96,66.04 P1.25
MOTOR_SELECT0
  Top 0.254: X1.21 95,46.99 91.95,46.99 91.19,47.75 62.48,47.75 59.18,51.05 59.18,63.25 58.42,64.01 58.42,66.04 P1.23
MOTOR_SELECT1  (via drill 0.51)
  Top 0.254: v91.95,48.26 62.74,48.26 59.69,51.31 P1.26
  Bottom 0.254: X1.23 95,44.45 92.96,44.45 91.95,45.47 v91.95,48.26
N$1
  Top 0.254: T1.B 44.38,34.73 R1.2
N$2
  Top 0.254: T2.B 40.57,34.73 R4.2
N$3
  Top 0.254: T3.B 48.19,34.74 R7.2
N$4
  Top 0.254: T4.B 36.76,34.73 R10.2
N$5
  Top 0.254: M8.1 78.6,6.35 R17.2 77.86,6.35 M7.1 M6.1 M5.1 M4.1 M3.1 M2.1 M1.1 41.77,6.35 R14.2 41.14,5.71 IC1.7
N$6
  Top 0.254: C32.2 15.34,59.34 16,59 16.38,59 VIDEO_MUX_1.1
N$7
  Top 0.254: 64.9,19.05 64.9,19.18 64.77,19.3
N$8
  Top 0.254: C41.1 16.39,56.47 VIDEO_MUX_1.3
N$9
  Top 0.254: U1.5 51.99,60.02 55.88,63.91 55.88,68.07 56.64,68.83 78.99,68.83 S0.2
N$10
  Top 0.254: U1.6 51.77,60.66 53.34,62.23 53.34,68.07 54.61,69.34 74.42,69.34 S1.2
N$11
  Top 0.254: U1.7 49.82,61.32 50.8,62.3 50.8,68.07 52.58,69.85 69.85,69.85 S2.2
N$12
  Top 0.254: U1.8 47.48,61.98 48.26,62.76 48.26,68.07 50.55,70.36 65.28,70.36 S3.2
N$13
  Top 0.254: C42.2 16.22,69.43 VIDEO_MUX_2.1
N$14
  Top 0.254: U1.15 39.03,58 38,58 37.4,57.4 R13.1
N$15
  Top 0.254: U1.14 37.3,58.73 C1.1
N$17
  Top 0.254: U1.12 34.5,60.02 30.5,64.02 30.5,68.13 34.76,72.39 46.99,72.39 S7.2
N$18
  Top 0.254: U1.11 34.62,60.66 33,62.27 33,69.83 35.05,71.88 51.56,71.88 S6.2
N$19
  Top 0.254: U1.10 36.44,61.32 35.56,62.19 35.56,69.85 37.08,71.37 56.13,71.37 S5.2
N$20
  Top 0.254: S4.2 60.71,70.87 39.12,70.87 38.1,69.85 38.1,62.23 38.35,61.98 U1.9
N$21
  Top 0.254: C43.1 13.97,66.55 14.22,66.8 VIDEO_MUX_2.3
N$22
  Top 0.254: M8.2 78.6,3.81 R17.1 77.86,3.81 M7.2 M6.2 M5.2 M4.2 M3.2 M2.2 M1.2 41.77,3.81 R14.1 41.14,4.45 IC1.6
PD7
  Top 0.305: P2.23 57.15,19.05 60.96,22.86 81.28,22.86 83.82,25.4 83.82,29.21 85.09,30.48 88.9,30.48 92.71,34.29 95.25,34.29 96.27,35.31 X1.29
PE2  (via drill 0.6)
  Top 0.305: v85.09,29.21 90.17,29.21 92.71,31.75 95.25,31.75 96.27,32.77 X1.31
  Bottom 0.305: P2.35 74.93,19.05 74.93,25.4 78.74,29.21 v85.09,29.21
PE4  (via drill 0.6)
  Top 0.305: v85.09,27.94 91.44,27.94 92.71,29.21 95.25,29.21 96.27,30.23 X1.33
  Bottom 0.305: P2.37 76.2,17.78 76.2,25.4 78.74,27.94 v85.09,27.94
PE6  (via drill 0.6)
  Top 0.305: v85.09,26.67 95.25,26.67 96.27,27.69 X1.35
  Bottom 0.305: P2.39 77.47,25.4 78.74,26.67 v85.09,26.67
PS1
  Bottom 0.254: P1.29 63.5,66.04 63.5,64.01 64.26,63.25 64.26,57.91 58.17,51.82 58.17,28.7 55.88,26.42 6.1,26.42 5.08,27.43 5.08,29.21 PS_IN.2
PS2
  Bottom 0.254: P1.30 64.77,57.66 58.67,51.56 58.67,28.45 56.13,25.91 5.84,25.91 PS_IN.3
PS3
  Bottom 0.254: P1.31 66.04,66.04 66.04,64.01 65.28,63.25 65.28,57.4 59.18,51.31 59.18,28.19 56.39,25.4 PS_IN.4
PS4
  Bottom 0.254: PS_IN.5 5.84,24.89 56.64,24.89 59.69,27.94 59.69,51.05 72.39,63.75 P1.36
PS5
  Bottom 0.254: P1.39 76.2,66.04 74.42,66.04 73.66,65.28 73.66,64.26 60.2,50.8 60.2,27.69 56.9,24.38 6.1,24.38 5.08,23.37 5.08,21.59 PS_IN.6
RE_6  (via drill 0.51)
  Top 0.254: IC1.2 30.61,5.71 v30.48,5.84
  Bottom 0.254: v30.48,5.84 30.48,7.62 34.29,12.19 P2.6
RX_2  (via drill 0.51)
  Top 0.254: U5.2 26.27,23.52 v26.16,23.37
  Bottom 0.254: P2.22 53.34,15.24 46.48,15.24 45.72,16 45.72,18.54 45.21,19.05 30.48,19.05 v26.16,23.37
RX_6  (via drill 0.51)
  Top 0.254: IC1.1 29.59,6.99 v29.46,6.86
  Bottom 0.254: v29.46,6.86 29.46,7.62 31.62,10.16 31.62,12.7 P2.4
SHIFT_CLK  (via drill 0.51)
  Top 0.254: U1.3 47.45,58.73 v47.75,58.42
  Bottom 0.254: v47.75,58.42 47.75,61.72 49.53,63.5 P1.18
SHIFT_DATA  (via drill 0.51)
  Top 0.254: U1.2 46.33,58.06 v46.48,57.91
  Bottom 0.254: P1.11 43.18,66.04 43.18,58.42 43.69,57.91 v46.48,57.91
SHIFT_LE
  Top 0.254: U1.4 48.64,59.36 51.31,56.64 51.31,17.27 P2.19
SHIFT_OE
  Top 0.254: U1.13 38.95,59.5 32.5,59.5 31.75,58.75 31.75,57.75 50.8,38.7 50.8,15.24 P2.18
TX_2  (via drill 0.51)
  Top 0.254: U5.3 27.54,23.52 v27.69,23.37
  Bottom 0.254: P1.38 60.71,50.55 60.71,27.43 57.15,23.88 28.19,23.88 v27.69,23.37
TX_6  (via drill 0.51)
  Top 0.254: IC1.4 29.59,3.17 v29.46,3.3
  Bottom 0.254: v29.46,3.3 28.45,4.32 28.45,7.62 30.48,10.16 30.48,15.24 P2.3
V_1
  Top 0.254: VIDEO_MUX_1.7 23.21,57.78 25,56 25,48.88 22.48,46.35 SURFACE.3
V_2  (via drill 0.51)
  Top 0.254: VIDEO_MUX_2.7 23.93,68.07 25,67 25,59 26,58 v26,50
  Bottom 0.254: v26,50 13.8,50 SURFACE.1
V_CTL_1  (via drill 0.51)
  Top 0.254: VIDEO_MUX_1.2 13.79,57.78 v13.5,57.5 | v17,51 v17,48.5 | v21.08,27.94 v21.08,23.11
  Bottom 0.254: v13.5,57.5 13.5,53.14 15.63,51 v17,51 | v17,48.5 19.56,45.97 20.32,45.97 21.08,45.21 v21.08,27.94 | v21.08,23.11 25.65,18.54 41.91,18.54 43.18,17.27 43.18,15.24 P2.14
V_CTL_2  (via drill 0.51)
  Top 0.254: VIDEO_MUX_2.2 v13.46,68.07 | v30.48,27.94 v30.48,22.86
  Bottom 0.254: v13.46,68.07 22.35,68.07 24.38,66.04 24.38,53.09 30.48,46.99 v30.48,27.94 | v30.48,22.86 30.48,20.83 31.75,19.56 45.47,19.56 46.99,18.03 P2.15
V_GND
  Bottom 0.406: SURFACE.4 SURFACE.2
  pour Top (isolate 0.254): 16.76,71.88 14.99,71.88 13.72,73.15 -0.51,73.15 -0.51,44.96 14.35,44.83 14.73,44.2 16.51,44.2
V_IN1
  Top 0.254: V1.2 6.35,60.85 7,61.5 13.01,61.5 C32.1
V_IN2
  Top 0.254: V2.2 6.35,56.35 7,57 11.74,57 12.24,56.56 C41.2
V_IN3
  Top 0.254: V3.2 6.35,71.58 7.12,72.31 13.55,72.31 C42.1
V_IN4
  Top 0.254: V4.2 6.35,63.65 7,63 13.05,63 C43.2
VDD
  Top 0.254: P1.47 P1.48 | R23.1 86.36,63.5 P1.48 | R22.1 88.9,63.5 P1.48
VDD_
  Top 0.254: P2.30 63.5,15.24 63.5,19.05 63.87,19.42 64.77,19.42 | 65.02,19.42 64.77,19.42 | 64.77,19.42 64.9,19.55 R18.1 R19.1
Y
  Top 0.254: SURFACE.5 19.16,43.81 R15.2 20.83,43.21 26.64,43.21 28.82,41.03 U5.5
Z
  Top 0.254: U5.6 27.5,38.53 27.5,41.59 26.44,42.65 R15.1 19.59,42.55 SURFACE.6

### Text on the board
tPlace: ROV X5 Adaptor Board